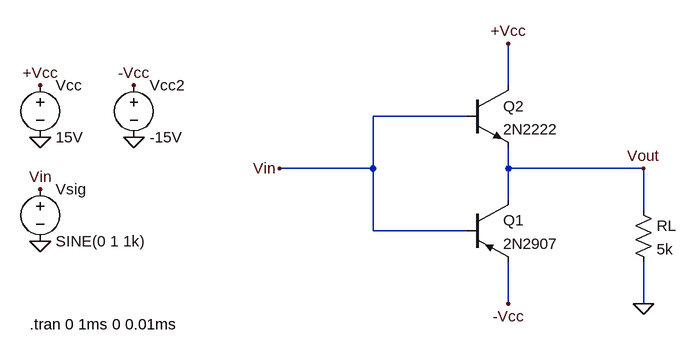
[diagram p0: schematic PushPull.asc]
PushPull.asc, the LTspice schematic file:
Version 4
SHEET 1 880 680
WIRE 288 -48 288 -112
WIRE 224 0 80 0
WIRE 80 80 80 0
WIRE 80 80 -64 80
WIRE 288 80 288 48
WIRE 496 80 288 80
WIRE 288 128 288 80
WIRE 496 144 496 80
WIRE 80 176 80 80
WIRE 224 176 80 176
WIRE 288 288 288 224
WIRE 496 288 496 224
FLAG 496 288 0
FLAG -432 32 0
FLAG -288 32 0
FLAG -432 192 0
FLAG -432 -48 +Vcc
FLAG -288 -48 -Vcc
FLAG -432 112 Vin
FLAG 288 288 -Vcc
FLAG 288 -112 +Vcc
FLAG -64 80 Vin
FLAG 496 80 Vout
SYMBOL pnp 224 128 R0
SYMATTR InstName Q1
SYMATTR Value 2N2907
SYMBOL npn 224 -48 R0
SYMATTR InstName Q2
SYMATTR Value 2N2222
SYMBOL res 480 128 R0
SYMATTR InstName RL
SYMATTR Value 5k
SYMBOL voltage -432 -64 R0
WINDOW 123 0 0 Left 0
WINDOW 39 0 0 Left 0
SYMATTR InstName Vcc
SYMATTR Value 15V
SYMBOL voltage -288 -64 R0
WINDOW 123 0 0 Left 0
WINDOW 39 0 0 Left 0
SYMATTR InstName Vcc2
SYMATTR Value -15V
SYMBOL voltage -432 96 R0
WINDOW 123 0 0 Left 0
WINDOW 39 0 0 Left 0
SYMATTR InstName Vsig
SYMATTR Value SINE(0 1 1k)
TEXT -448 320 Left 2 !.tran 0 1ms 0 0.01ms

The netlist it stands for:
* PushPull.asc
Q1 Vout Vin -Vcc 0 2N2907
Q2 +Vcc Vin Vout 0 2N2222
RL Vout 0 5k
Vcc +Vcc 0 15V
Vcc2 -Vcc 0 -15V
Vsig Vin 0 SINE(0 1 1k)
.model NPN NPN
.model PNP PNP
.lib standard.bjt
.tran 0 1ms 0 0.01ms
.backanno
.end

* Results of the author's LTspice run, read from the files saved beside the schematic
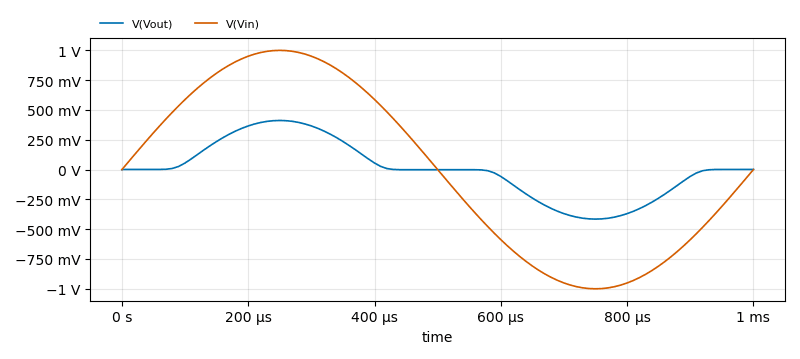
[diagram p1: Transient Analysis of PushPull.asc, plotted from the saved traces]
* Transient Analysis, 1 run:
*   V(Vout): min -415.4 mV, max 411.9 mV, average -1.063 mV, rms 237 mV, last 1.035 mV
*   V(Vin): min -1 V, max 1 V, average 358.4 nV, rms 707.3 mV, last 0 V